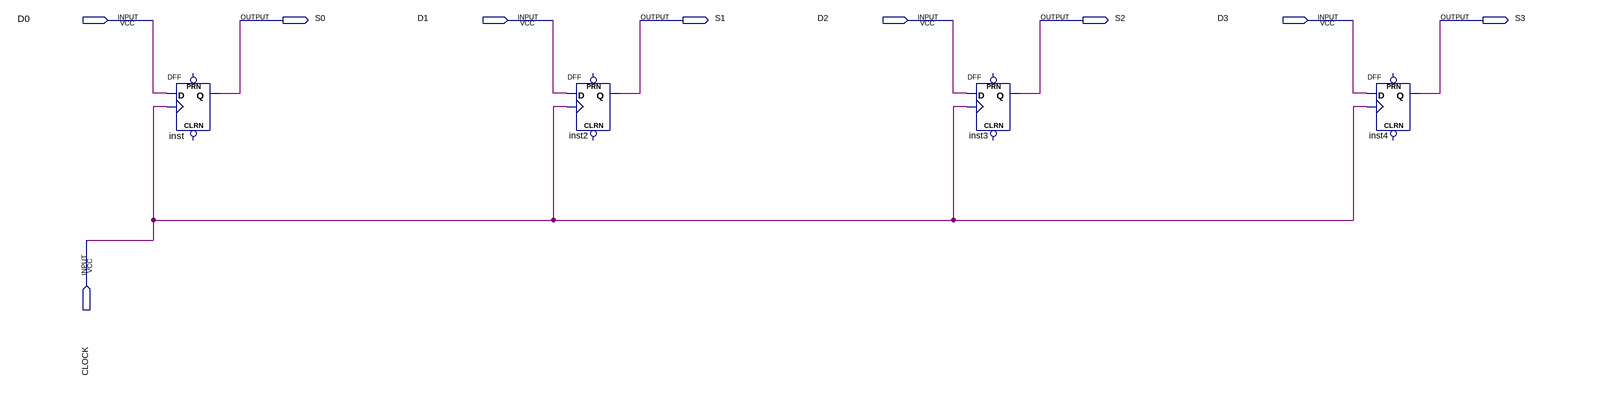
[diagram p0: schematic sheet]
// Quartus schematic Reg4Bits.bdf as structural Verilog: 4 symbols, 9 pins
module Reg4Bits (
  input  D0,
  input  D1,
  input  D2,
  input  D3,
  input  CLOCK,
  output S0,
  output S1,
  output S2,
  output S3
);

  DFF inst (.CLK(CLOCK), .D(D0), .Q(S0));  // open: CLRN, PRN
  DFF inst2 (.CLK(CLOCK), .D(D1), .Q(S1));  // open: CLRN, PRN
  DFF inst3 (.CLK(CLOCK), .D(D2), .Q(S2));  // open: CLRN, PRN
  DFF inst4 (.CLK(CLOCK), .D(D3), .Q(S3));  // open: CLRN, PRN
endmodule
